# Altium schematic sheet PRUC-Voltmeter_Connectors.SchDoc
size A4; SheetNumber: 1; SheetTotal: 9; Time: Voltmeter / Connectors
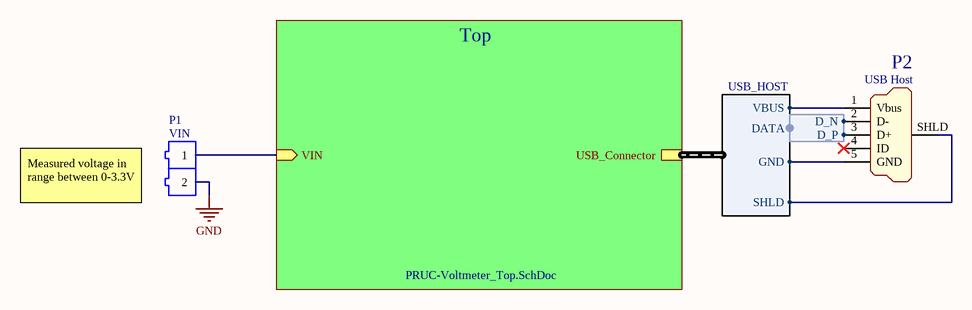
[diagram p0: PRUC-Voltmeter_Connectors.SchDoc]

## Parts
P1  VIN  [DS1021-02G]
P2  USB Host  [USB_Mini-B_Molex_SMT]

## Sub-sheets
Top = PRUC-Voltmeter_Top.SchDoc: USB_Connector (harness USB_HOST), VIN (in)

## Harnesses
USB_HOST: DATA, VBUS, GND, SHLD
USB: D_P, D_N

## Nets
GND: P1.2
NetP1_1: P1.1 ; sheet Top/VIN
NetP2_1: P2.1(Vbus) ; sheet Top/USB_Connector.VBUS
NetP2_2: P2.2(D-) ; harness USB.D_N
NetP2_3: P2.3(D+) ; harness USB.D_P
NetP2_5: P2.5(GND) ; sheet Top/USB_Connector.GND
NetP2_SHLD: P2.SHLD(SHIELD) ; sheet Top/USB_Connector.SHLD

Not connected (* = marked no-connect by the designer): P2 4(ID)*

## Notes on the sheet
- Measured voltage in range between 0-3.3V
- Project:
- Title:
- Variant Name:
- Author:
- Checked by:
- Ver/Rev:
- Date:
- Approved by:
- Sheet:
- of
- File name:

## Library data of the parts
P1 = ZL201-02G: Manufacturer: Connfly; Manufacturer Part Number: DS1021-1*2SF1-1B; Part Description: 2.54mm PIN Header V/T Type. Single Row; Index: 80; Value: 1x2/2.54mm; Part Number: ZL201-02G; SMD: false; Supplier 1: TME; Supplier Part Number 1: ZL201-02G; HelpURL: https://www.tme.eu/Document/cc301e58a5da78cb543a94b5a5b7f06a/DS1021.pdf; Category: Connectors
P2 = 67503-1020: Manufacturer: Molex; Part Description: Connector SMD USB Type Mini-B; Index: 93; Value: USB Mini-B; Part Number: 67503-1020; SMD: true; Manufacturer Part Number: 67503-1020; Supplier 1: TME; Supplier Part Number 1: MX-67503-1020; HelpURL: https://www.tme.eu/Document/0b54384a2825f7831cf676dc2fc979b6/MX-67503-1020.pdf; Category: Connectors